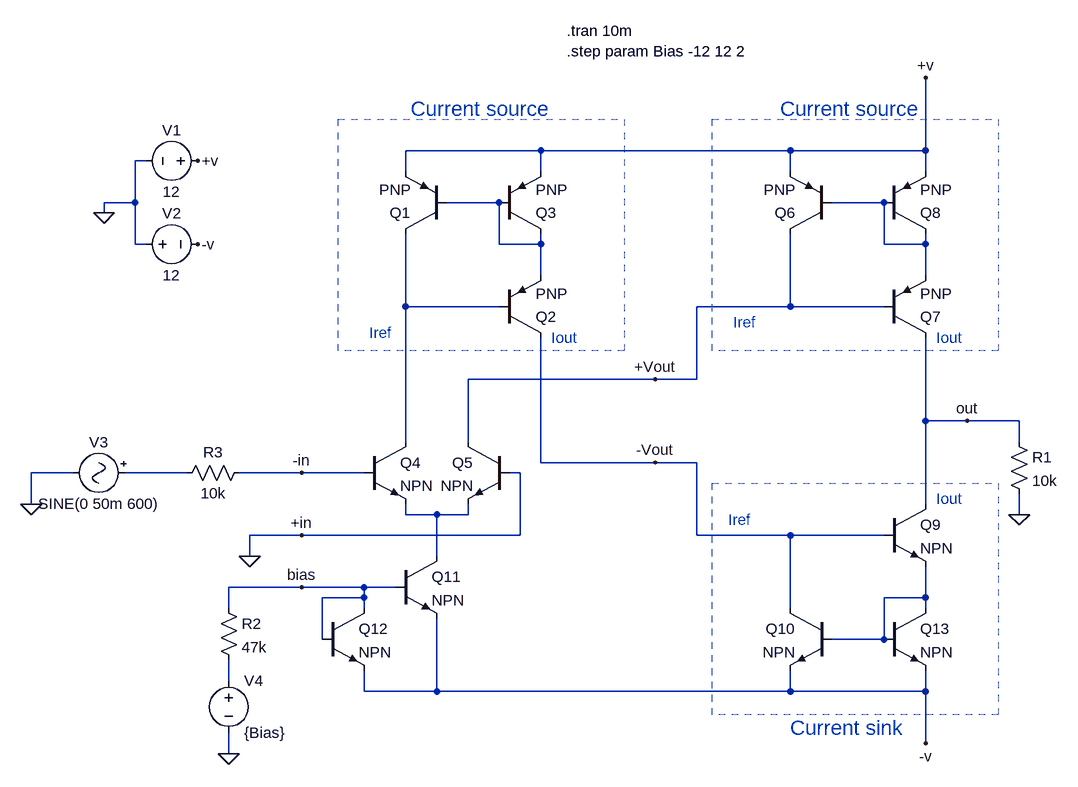
[diagram p0: schematic operational-transconductance-amplifier.asc]
operational-transconductance-amplifier.asc, the LTspice schematic file:
Version 4
SHEET 1 1184 964
WIRE 336 -32 128 -32
WIRE 720 -32 336 -32
WIRE 928 -32 928 -144
WIRE 928 -32 720 -32
WIRE -272 -16 -288 -16
WIRE 128 0 128 -32
WIRE 336 0 336 -32
WIRE 720 0 720 -32
WIRE 928 0 928 -32
WIRE -288 48 -288 -16
WIRE -288 48 -336 48
WIRE 272 48 192 48
WIRE 864 48 784 48
WIRE -336 64 -336 48
WIRE -288 112 -288 48
WIRE -272 112 -288 112
WIRE 272 112 272 48
WIRE 336 112 336 96
WIRE 336 112 272 112
WIRE 864 112 864 48
WIRE 928 112 928 96
WIRE 928 112 864 112
WIRE 336 160 336 112
WIRE 928 160 928 112
WIRE 128 208 128 96
WIRE 272 208 128 208
WIRE 720 208 720 96
WIRE 720 208 576 208
WIRE 864 208 720 208
WIRE 512 320 224 320
WIRE 576 320 576 208
WIRE 576 320 512 320
WIRE 928 384 928 256
WIRE 992 384 928 384
WIRE 1072 384 992 384
WIRE 128 416 128 208
WIRE 224 416 224 320
WIRE 1072 416 1072 384
WIRE 336 448 336 256
WIRE 512 448 336 448
WIRE 576 448 512 448
WIRE -384 464 -448 464
WIRE -208 464 -304 464
WIRE -32 464 -128 464
WIRE 64 464 -32 464
WIRE 304 464 288 464
WIRE -448 512 -448 464
WIRE 928 512 928 384
WIRE 128 528 128 512
WIRE 176 528 128 528
WIRE 224 528 224 512
WIRE 224 528 176 528
WIRE 1072 528 1072 496
WIRE -32 560 -112 560
WIRE 304 560 304 464
WIRE 304 560 -32 560
WIRE 576 560 576 448
WIRE 720 560 576 560
WIRE 864 560 720 560
WIRE -112 592 -112 560
WIRE 176 592 176 528
WIRE -32 640 -144 640
WIRE 64 640 -32 640
WIRE 112 640 64 640
WIRE 64 656 64 640
WIRE 64 656 0 656
WIRE 928 656 928 608
WIRE 928 656 864 656
WIRE -144 672 -144 640
WIRE 64 672 64 656
WIRE 720 672 720 560
WIRE 928 672 928 656
WIRE 0 720 0 656
WIRE 864 720 864 656
WIRE 864 720 784 720
WIRE -144 784 -144 752
WIRE 64 800 64 768
WIRE 176 800 176 688
WIRE 176 800 64 800
WIRE 720 800 720 768
WIRE 720 800 176 800
WIRE 928 800 928 768
WIRE 928 800 720 800
WIRE 928 880 928 800
WIRE -144 896 -144 864
FLAG 992 384 out
FLAG -32 464 -in
FLAG -32 560 +in
FLAG -32 640 bias
FLAG 928 -144 +v
FLAG 928 880 -v
FLAG -336 64 0
FLAG -192 -16 +v
FLAG -192 112 -v
FLAG -112 592 0
FLAG 1072 528 0
FLAG -448 512 0
FLAG -144 896 0
FLAG 512 448 -Vout
FLAG 512 320 +Vout
SYMBOL pnp 192 96 R180
SYMATTR InstName Q1
SYMBOL pnp 272 256 M180
SYMATTR InstName Q2
SYMBOL npn 64 416 R0
SYMATTR InstName Q4
SYMBOL npn 288 416 M0
SYMATTR InstName Q5
SYMBOL pnp 784 96 R180
SYMATTR InstName Q6
SYMBOL pnp 864 256 M180
SYMATTR InstName Q7
SYMBOL npn 864 512 R0
SYMATTR InstName Q9
SYMBOL npn 784 672 M0
SYMATTR InstName Q10
SYMBOL npn 112 592 R0
SYMATTR InstName Q11
SYMBOL voltage -176 -16 R90
WINDOW 0 -32 56 VBottom 2
WINDOW 3 32 56 VTop 2
SYMATTR InstName V1
SYMATTR Value 12
SYMBOL voltage -288 112 R270
WINDOW 0 32 56 VTop 2
WINDOW 3 -32 56 VBottom 2
SYMATTR InstName V2
SYMATTR Value 12
SYMBOL res 1056 400 R0
SYMATTR InstName R1
SYMATTR Value 10k
SYMBOL Misc/signal -288 464 R90
WINDOW 0 -32 56 VBottom 2
WINDOW 3 32 56 VTop 2
SYMATTR InstName V3
SYMATTR Value SINE(0 50m 600)
SYMBOL res -160 656 R0
SYMATTR InstName R2
SYMATTR Value 47k
SYMBOL voltage -144 768 R0
SYMATTR InstName V4
SYMATTR Value {Bias}
SYMBOL res -112 448 R90
WINDOW 0 0 56 VBottom 2
WINDOW 3 32 56 VTop 2
SYMATTR InstName R3
SYMATTR Value 10k
SYMBOL npn 0 672 R0
SYMATTR InstName Q12
SYMBOL npn 864 672 R0
SYMATTR InstName Q13
SYMBOL pnp 272 96 M180
SYMATTR InstName Q3
SYMBOL pnp 864 96 M180
SYMATTR InstName Q8
TEXT 376 -216 Left 2 !.tran 10m\n.step param Bias -12 12 2
TEXT 136 -96 Left 3 ;Current source
TEXT 704 -96 Left 3 ;Current source
TEXT 720 856 Left 3 ;Current sink
TEXT 72 248 Left 2 ;Iref
TEXT 632 232 Left 2 ;Iref
TEXT 624 536 Left 2 ;Iref
TEXT 944 256 Left 2 ;Iout
TEXT 352 256 Left 2 ;Iout
TEXT 944 504 Left 2 ;Iout
RECTANGLE Normal 24 -80 464 276 2
RECTANGLE Normal 600 -80 1040 276 2
RECTANGLE Normal 600 480 1040 836 2

The netlist it stands for:
* operational-transconductance-amplifier.asc
Q1 N003 N001 +v 0 PNP
Q2 -Vout N003 N001 0 PNP
Q4 N003 -in N005 0 NPN
Q5 +Vout 0 N005 0 NPN
Q6 +Vout N002 +v 0 PNP
Q7 out +Vout N002 0 PNP
Q9 out -Vout N006 0 NPN
Q10 -Vout N006 -v 0 NPN
Q11 N005 bias -v 0 NPN
V1 +v 0 12
V2 0 -v 12
R1 out 0 10k
V3 N004 0 SINE(0 50m 600)
R2 bias N007 47k
V4 N007 0 {Bias}
R3 -in N004 10k
Q12 bias bias -v 0 NPN
Q13 N006 N006 -v 0 NPN
Q3 N001 N001 +v 0 PNP
Q8 N002 N002 +v 0 PNP
.model NPN NPN
.model PNP PNP
.lib standard.bjt
.tran 10m
.step param Bias -12 12 2
* Current source
* Current source
* Current sink
* Iref
* Iref
* Iref
* Iout
* Iout
* Iout
.backanno
.end